# Altium schematic sheet System Timer.SchDoc: System Timer Controller
size A4; SheetNumber: 7; SheetTotal: 37
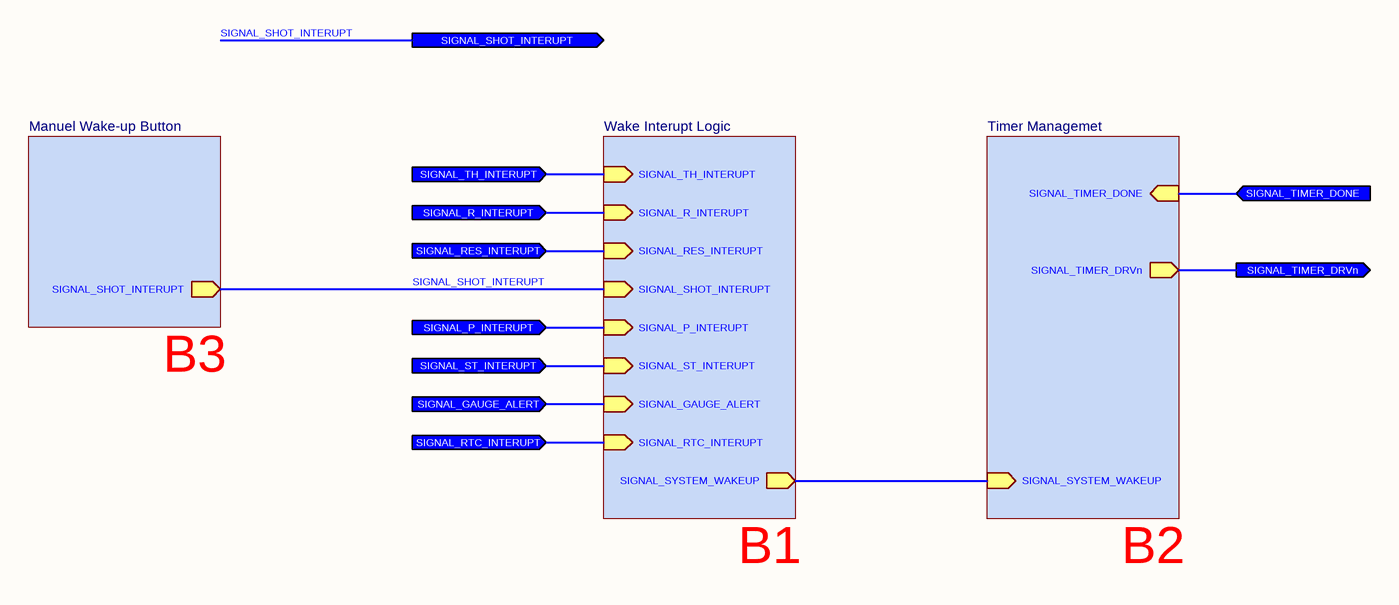
[diagram p0: System Timer.SchDoc]

## Sub-sheets
Manuel Wake-up Button = Manuel Wake-up and Latch.SchDoc: SIGNAL_SHOT_INTERUPT (out)
Timer Managemet = Time Management.SchDoc: SIGNAL_TIMER_DRVn (out), SIGNAL_TIMER_DONE (in), SIGNAL_SYSTEM_WAKEUP (in)
Wake Interupt Logic = System Wake Interupt Logic.SchDoc: SIGNAL_R_INTERUPT (in), SIGNAL_ST_INTERUPT (in), SIGNAL_SYSTEM_WAKEUP (out), SIGNAL_TH_INTERUPT (in), SIGNAL_RES_INTERUPT (in), SIGNAL_RTC_INTERUPT (in), SIGNAL_GAUGE_ALERT (in), SIGNAL_P_INTERUPT (in), SIGNAL_SHOT_INTERUPT (in)

## Ports
SIGNAL_GAUGE_ALERT (in), SIGNAL_P_INTERUPT (in), SIGNAL_R_INTERUPT (in), SIGNAL_RES_INTERUPT (in), SIGNAL_RTC_INTERUPT (in), SIGNAL_SHOT_INTERUPT (out), SIGNAL_ST_INTERUPT (in), SIGNAL_TH_INTERUPT (in), SIGNAL_TIMER_DONE (in), SIGNAL_TIMER_DRVn (out)

## Nets
SIGNAL_GAUGE_ALERT: port SIGNAL_GAUGE_ALERT, sheet Wake Interupt Logic/SIGNAL_GAUGE_ALERT
SIGNAL_P_INTERUPT: port SIGNAL_P_INTERUPT, sheet Wake Interupt Logic/SIGNAL_P_INTERUPT
SIGNAL_R_INTERUPT: port SIGNAL_R_INTERUPT, sheet Wake Interupt Logic/SIGNAL_R_INTERUPT
SIGNAL_RES_INTERUPT: port SIGNAL_RES_INTERUPT, sheet Wake Interupt Logic/SIGNAL_RES_INTERUPT
SIGNAL_RTC_INTERUPT: port SIGNAL_RTC_INTERUPT, sheet Wake Interupt Logic/SIGNAL_RTC_INTERUPT
SIGNAL_SHOT_INTERUPT: port SIGNAL_SHOT_INTERUPT, sheet Wake Interupt Logic/SIGNAL_SHOT_INTERUPT, sheet Manuel Wake-up Button/SIGNAL_SHOT_INTERUPT
SIGNAL_ST_INTERUPT: port SIGNAL_ST_INTERUPT, sheet Wake Interupt Logic/SIGNAL_ST_INTERUPT
SIGNAL_TH_INTERUPT: port SIGNAL_TH_INTERUPT, sheet Wake Interupt Logic/SIGNAL_TH_INTERUPT
SIGNAL_TIMER_DONE: port SIGNAL_TIMER_DONE, sheet Timer Managemet/SIGNAL_TIMER_DONE
SIGNAL_TIMER_DRVn: port SIGNAL_TIMER_DRVn, sheet Timer Managemet/SIGNAL_TIMER_DRVn
(unnamed): sheet Timer Managemet/SIGNAL_SYSTEM_WAKEUP, sheet Wake Interupt Logic/SIGNAL_SYSTEM_WAKEUP

## Notes on the sheet
- B3
- B1
- B2
- Title
- Size:
- Date:
- A4
- Number:
- Time:
- Revision:
- Sheet
- of
- File: